# EAGLE schematic untitled (EAGLE 7.7.0)
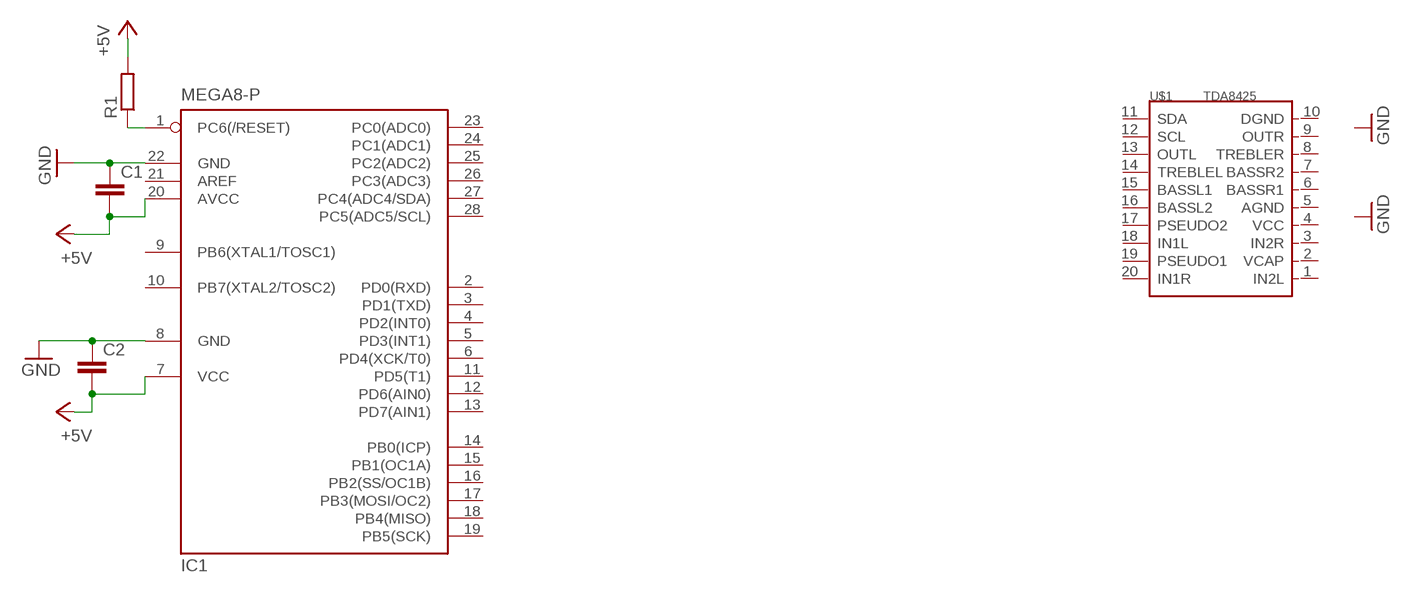
[diagram p0: schematic, sheet 1]

## Parts
C1  C-EUC0805  [C0805]
C2  C-EUC0805  [C0805]
IC1  MEGA8-P  [DIL28-3]
R1  R-EU_R0805  [R0805]
U$1  TDA8425  [DIP20-2.54-26.2X7.62MM]

## Nets
+5V: C1.2 C2.2 IC1.7(VCC) IC1.20(AVCC) R1.2
GND: C1.1 C2.1 IC1.8(GND) IC1.22(GND)
N$1: IC1.1(PC6(/RESET)) R1.1
Unconnected: IC1.2(PD0(RXD)) IC1.3(PD1(TXD)) IC1.4(PD2(INT0)) IC1.5(PD3(INT1)) IC1.6(PD4(XCK/T0)) IC1.9(PB6(XTAL1/TOSC1)) IC1.10(PB7(XTAL2/TOSC2)) IC1.11(PD5(T1)) IC1.12(PD6(AIN0)) IC1.13(PD7(AIN1)) IC1.14(PB0(ICP)) IC1.15(PB1(OC1A)) IC1.16(PB2(SS/OC1B)) IC1.17(PB3(MOSI/OC2)) IC1.18(PB4(MISO)) IC1.19(PB5(SCK)) IC1.21(AREF) IC1.23(PC0(ADC0)) IC1.24(PC1(ADC1)) IC1.25(PC2(ADC2)) IC1.26(PC3(ADC3)) IC1.27(PC4(ADC4/SDA)) IC1.28(PC5(ADC5/SCL)) U$1.1(IN2L) U$1.2(VCAP) U$1.3(IN2R) U$1.4(VCC) U$1.5(AGND) U$1.6(BASSR1) U$1.7(BASSR2) U$1.8(TREBLER) U$1.9(OUTR) U$1.10(DGND) U$1.11(SDA) U$1.12(SCL) U$1.13(OUTL) U$1.14(TREBLEL) U$1.15(BASSL1) U$1.16(BASSL2) U$1.17(PSEUDO2) U$1.18(IN1L) U$1.19(PSEUDO1) U$1.20(IN1R)

## Library data of the parts
C1 C2 = rcl:C-EU: CAPACITOR, European symbol
IC1 = atmel:MEGA8-P: MICROCONTROLLER 8 Kbytes FLASH, 1 kbytes SRAM, 512 bytes EEPROM, USART, 4-channel 10 bit ADC, 2-channel 8 bit ADC Pin compatible with Atmega48, ATMega88, ATMega168 Source: avr.lbr; OC_FARNELL: unknown; OC_NEWARK: unknown
R1 = rcl:R-EU_: RESISTOR, European symbol
U$1 = my_electronics_library:TDA8425